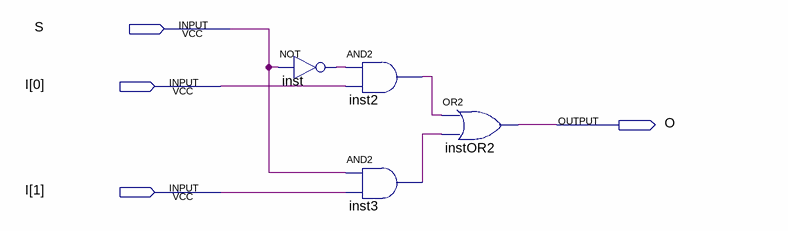
[diagram p0: schematic sheet]
// Quartus schematic Mux2.bdf as structural Verilog: 4 symbols, 4 pins
module Mux2 (
  input  S,
  input  [1:0] I,
  output O
);

  wire inst2_out, inst3_out, inst_out;

  not inst (inst_out, S);
  and inst2 (inst2_out, inst_out, I[0]);
  and inst3 (inst3_out, S, I[1]);
  or instOR2 (O, inst2_out, inst3_out);
endmodule
